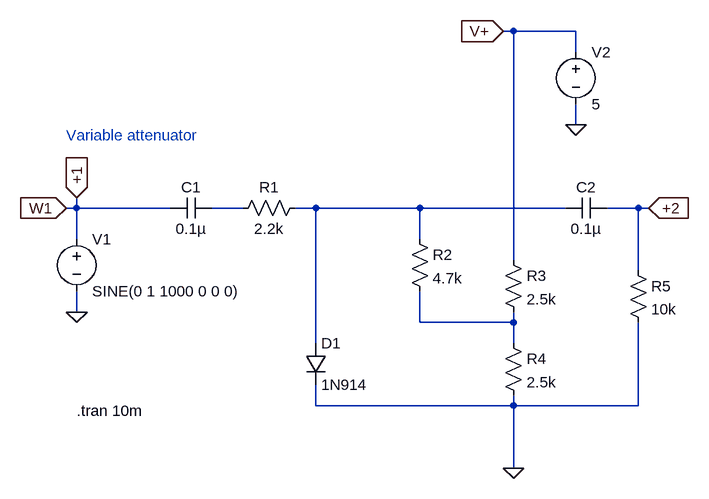
[diagram p0: schematic variable_attenuator.asc]
variable_attenuator.asc, the LTspice schematic file:
Version 4
SHEET 1 880 680
WIRE 416 -160 400 -160
WIRE 512 -160 416 -160
WIRE 512 -128 512 -160
WIRE 512 -16 512 -48
WIRE -256 112 -256 96
WIRE -256 112 -272 112
WIRE -112 112 -256 112
WIRE 0 112 -48 112
WIRE 112 112 80 112
WIRE 272 112 112 112
WIRE 496 112 272 112
WIRE 608 112 560 112
WIRE 624 112 608 112
WIRE -256 160 -256 112
WIRE 272 160 272 112
WIRE 416 192 416 -160
WIRE 608 208 608 112
WIRE -256 272 -256 240
WIRE 272 288 272 240
WIRE 416 288 416 272
WIRE 416 288 272 288
WIRE 112 320 112 112
WIRE 416 320 416 288
WIRE 112 416 112 384
WIRE 416 416 416 400
WIRE 416 416 112 416
WIRE 608 416 608 288
WIRE 608 416 416 416
WIRE 416 512 416 416
FLAG -256 272 0
FLAG 512 -16 0
FLAG 416 512 0
FLAG -272 112 W1
IOPIN -272 112 In
FLAG -256 96 +1
IOPIN -256 96 In
FLAG 400 -160 V+
IOPIN 400 -160 In
FLAG 624 112 +2
IOPIN 624 112 In
SYMBOL diode 96 320 R0
SYMATTR InstName D1
SYMATTR Value 1N914
SYMBOL voltage -256 144 R0
WINDOW 123 0 0 Left 0
WINDOW 39 0 0 Left 0
SYMATTR InstName V1
SYMATTR Value SINE(0 1 1000 0 0 0)
SYMBOL cap -48 96 R90
WINDOW 0 0 32 VBottom 2
WINDOW 3 32 32 VTop 2
SYMATTR InstName C1
SYMATTR Value 0.1µ
SYMBOL res 96 96 R90
WINDOW 0 0 56 VBottom 2
WINDOW 3 32 56 VTop 2
SYMATTR InstName R1
SYMATTR Value 2.2k
SYMBOL res 256 144 R0
SYMATTR InstName R2
SYMATTR Value 4.7k
SYMBOL res 400 176 R0
SYMATTR InstName R3
SYMATTR Value 2.5k
SYMBOL res 400 304 R0
SYMATTR InstName R4
SYMATTR Value 2.5k
SYMBOL voltage 512 -144 R0
WINDOW 123 0 0 Left 0
WINDOW 39 0 0 Left 0
SYMATTR InstName V2
SYMATTR Value 5
SYMBOL cap 560 96 R90
WINDOW 0 0 32 VBottom 2
WINDOW 3 32 32 VTop 2
SYMATTR InstName C2
SYMATTR Value 0.1µ
SYMBOL res 592 192 R0
SYMATTR InstName R5
SYMATTR Value 10k
TEXT -272 0 Left 2 ;Variable attenuator
TEXT -256 424 Left 2 !.tran 10m

The netlist it stands for:
* variable_attenuator.asc
D1 N002 0 1N914
V1 +1 0 SINE(0 1 1000 0 0 0)
C1 N001 +1 0.1µ
R1 N002 N001 2.2k
R2 N002 N003 4.7k
R3 V+ N003 2.5k
R4 N003 0 2.5k
V2 V+ 0 5
C2 +2 N002 0.1µ
R5 +2 0 10k
.model D D
.lib standard.dio
* Variable attenuator
.tran 10m
.backanno
.end